# EAGLE design 454_mic (EAGLE 9.1.1)
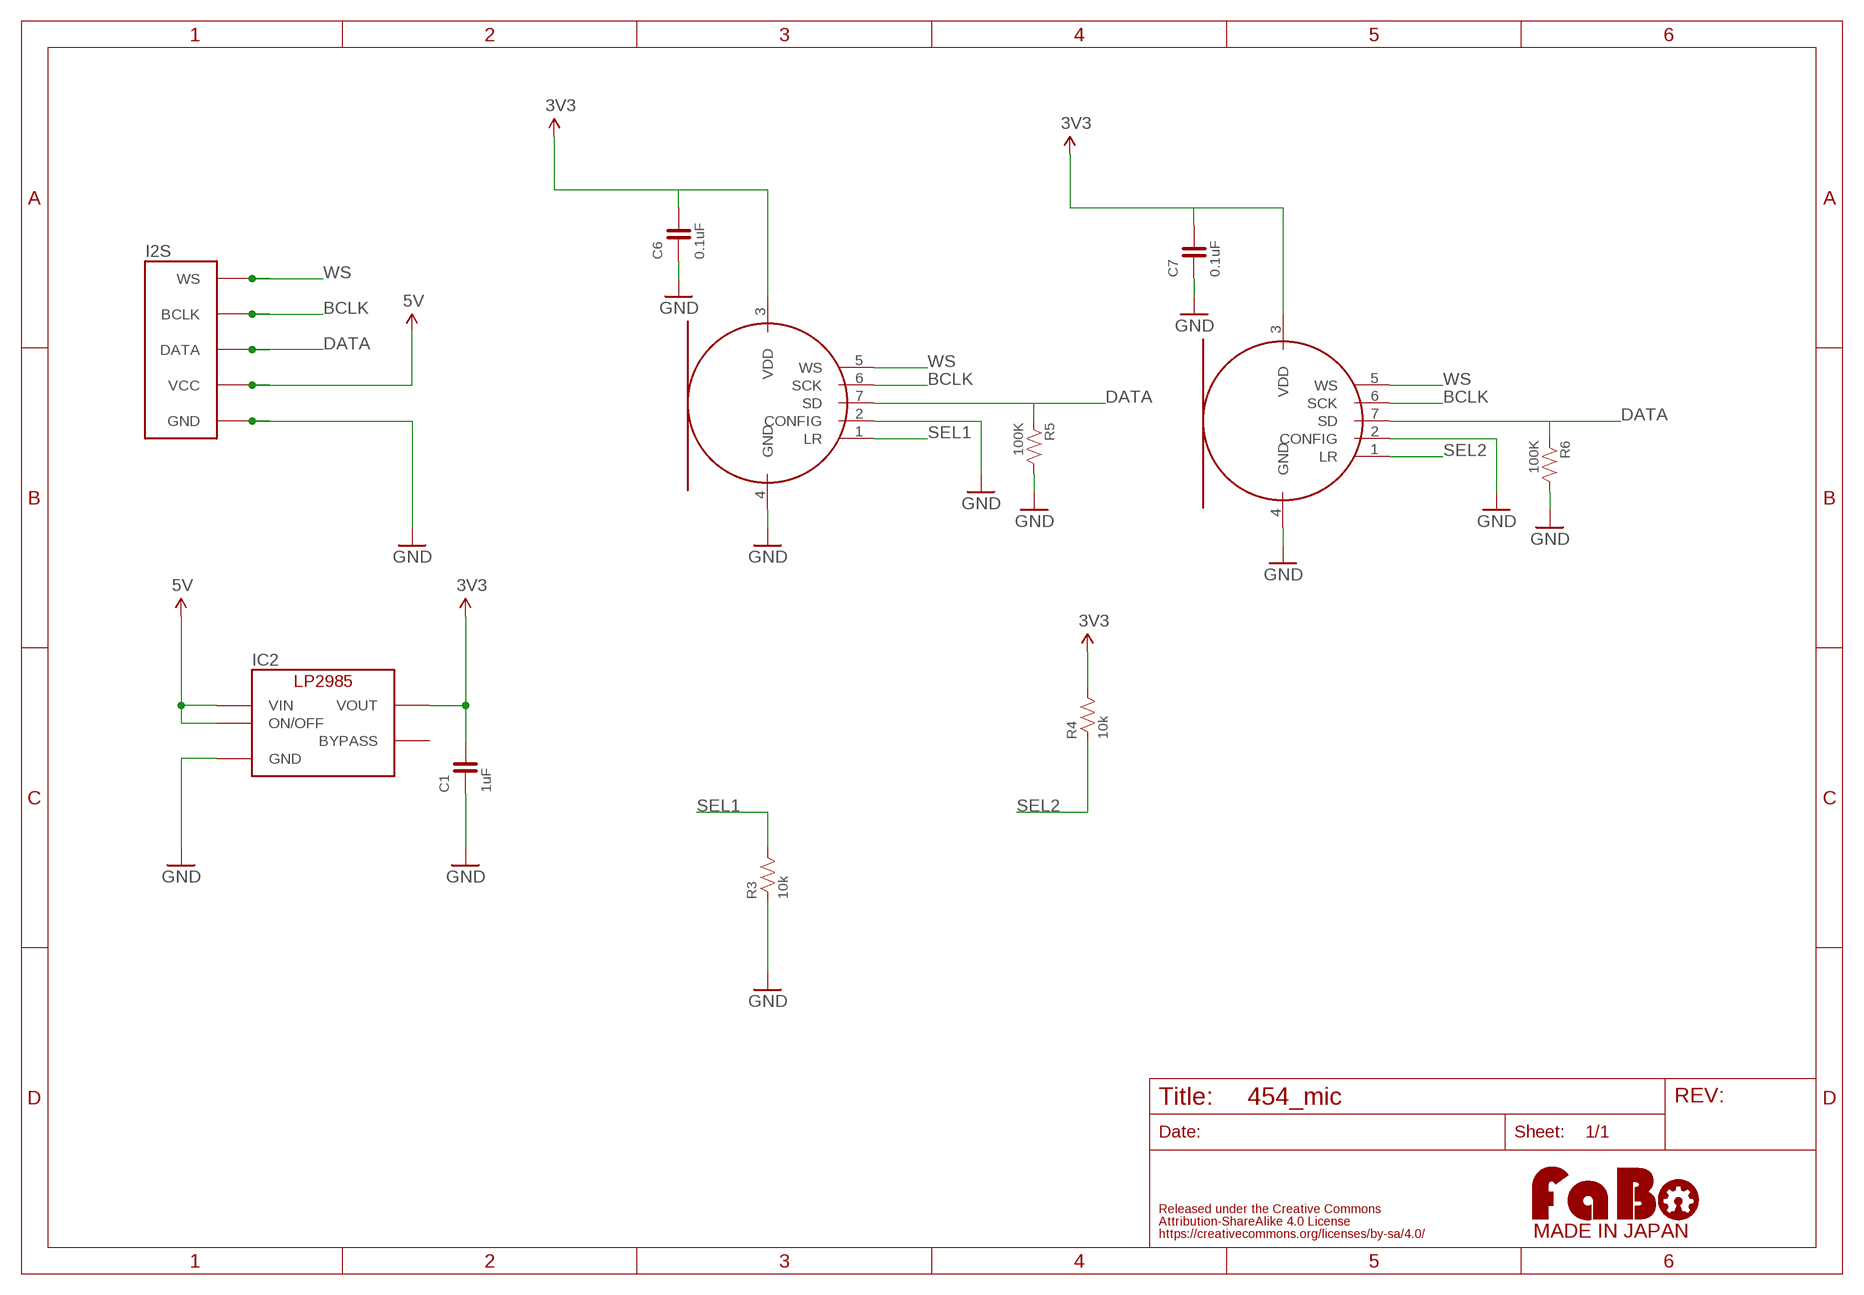
[diagram p0: schematic, sheet 1]

## Parts
C1  1uF  CAPACITOR-0603  [0603]
C6  0.1uF  CAPACITOR-0603  [0603]
C7  0.1uF  CAPACITOR-0603  [0603]
I2S  FABO_BRICK_I2SLONG  [FABO_BRICK_I2S_S05B-PASK-2_LONG]
IC2  LP2985-33DBV  [SOT-23-5]
MIC_LEFT  TDK-ICS43432  [TDK-ICS43432]
MIC_RIGHT  TDK-ICS43432  [TDK-ICS43432]
R3  10k  RESISTOR-0603  [0603]
R4  10k  RESISTOR-0603  [0603]
R5  100K  RESISTOR-0603  [0603]
R6  100K  RESISTOR-0603  [0603]
U$3  LOGO_FABO-M_BOTTOM  [LOGO_FABO_MS_BOTTOM]

## Nets
3V3: C1.2 C6.2 C7.2 IC2.5(VOUT) MIC_LEFT.3(VDD) MIC_RIGHT.3(VDD) R4.2
5V: I2S.VCC IC2.1(VIN) IC2.3(ON/OFF)
BCLK: I2S.BCLK MIC_LEFT.6(SCK) MIC_RIGHT.6(SCK)
DATA: I2S.DATA MIC_LEFT.7(SD) MIC_RIGHT.7(SD) R5.1 R6.1
GND: C1.1 C6.1 C7.1 I2S.GND IC2.2(GND) MIC_LEFT.2(CONFIG) MIC_LEFT.4(GND) MIC_RIGHT.2(CONFIG) MIC_RIGHT.4(GND) R3.1 R5.2 R6.2
SEL1: MIC_LEFT.1(LR) R3.2
SEL2: MIC_RIGHT.1(LR) R4.1
WS: I2S.WS MIC_LEFT.5(WS) MIC_RIGHT.5(WS)
Unconnected: IC2.4(BYPASS)

## Library data of the parts
C1 C6 C7 = FaBo-Capacitor:CAPACITOR: CAPACITOR
I2S = FaBo-Template:FABO_BRICK_I2S
IC2 = FaBo-Supply:LP2985: LP2985
MIC_LEFT MIC_RIGHT = FaBo-Mems:TDK-ICS43432
R3-R6 = FaBo-Resistors:RESISTOR: RESISTOR
U$3 = FaBo-etc:LOGO_FABO

## Board
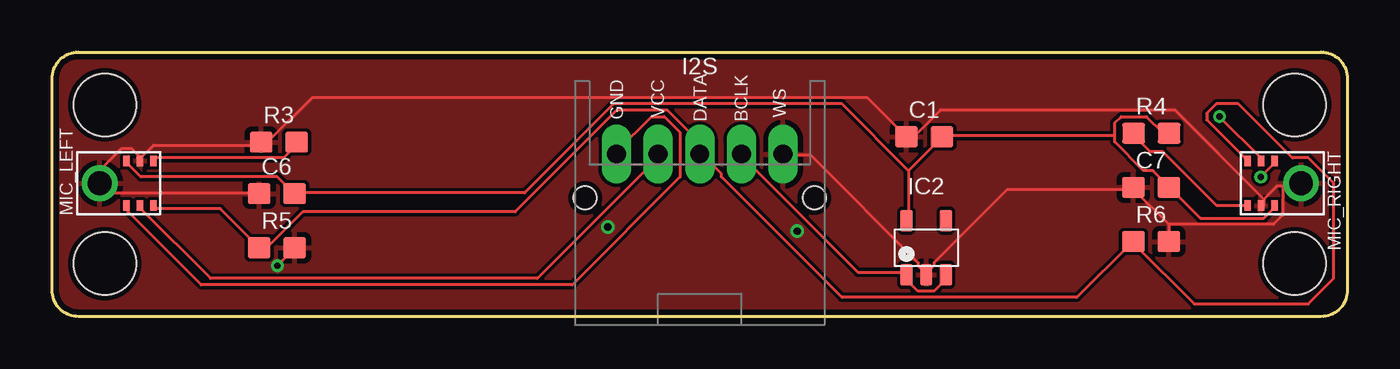
[diagram p1: board, top side]
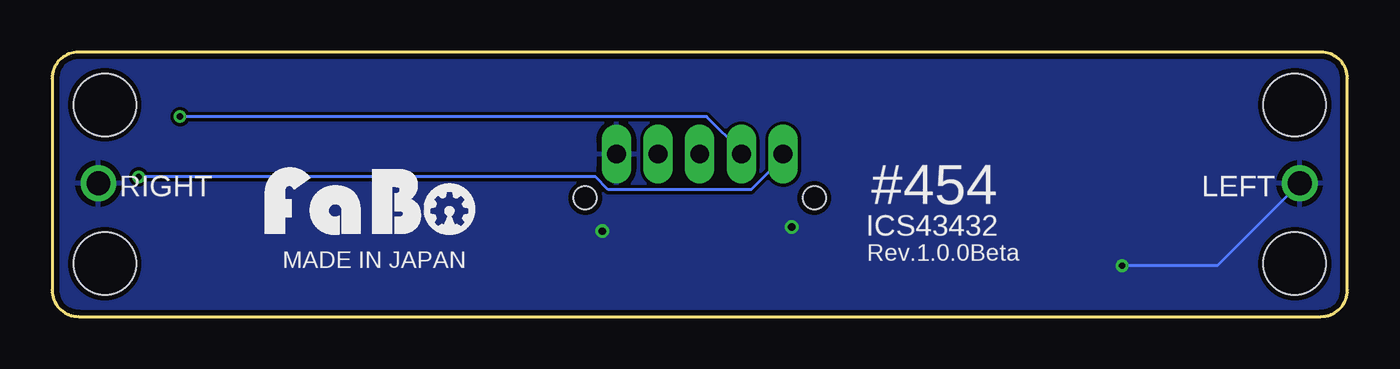
[diagram p2: board, bottom side, seen from below]

Size 62.23 x 12.7 mm. Coordinates in mm from the lower left corner, seen from the top.
Outline: 1.27,12.7 60.96,12.7 arc-90 62.23,11.43 62.23,1.27 arc-90 60.96,0 1.27,0 arc-90 0,1.27 0,11.43 arc-90 1.27,12.7
Copper layers (1*16): Top 0.035mm / dielectric 1.5mm / Bottom 0.035mm
Design rules "Elecrow_angle": minimum track width 6mil, minimum drill 12mil, track to track 6mil, track to pad 6mil, pad to pad 6mil, via to via 6mil, smd to smd 0mil, copper to edge 10mil, drill to drill 10mil, minimum pad ring 10mil, minimum via ring 6mil, stop-mask expansion 2mil, vias tented up to drill 100mil, thermal gap 10mil
Holes 3 mm at 2.54,10.16 2.54,2.54 59.69,10.16 59.69,2.54

### Footprints (pad centres in the part's own frame; a part is rotated, then mirrored left to right if it is on the bottom)
0603 = smd 1.1 x 1: 1 -0.85,0; 2 0.85,0
FABO_BRICK_I2S_S05B-PASK-2_LONG = drill 0.9 pad 1.422 long: BCLK 3,0; DATA 1,0; GND -3,0; VCC -1,0; WS 5,0 | hole 1.1: 6.5,2.1; -4.5,2.1
SOT-23-5 = smd 0.6 x 1.05: 1 -0.95,-1.3; 2 0,-1.3; 3 0.95,-1.3; 4 0.95,1.3; 5 -0.95,1.3
TDK-ICS43432 = smd 0.5 x 0.3: 1 1.075,-2.575; 2 1.075,-1.925; 3 1.075,-1.275; 5 -1.075,-1.275; 6 -1.075,-1.925; 7 -1.075,-2.575 | drill 1.15 pad 1.65: 4 0,0

### Placement (x,y rotation side)
C1  41.9,8.63 0 top
C6  10.8,5.9 0 top
C7  52.8,6.2 0 top
I2S  32.12,7.8 180 top
IC2  41.99,3.31 0 top
MIC_LEFT  2.3,6.4 90 top
MIC_RIGHT  60,6.4 270 top
R3  10.89,8.38 0 top
R4  52.81,8.8 0 top
R5  10.8,3.3 0 top
R6  52.8,3.6 0 top
U$3  46.95,3.54 0 top

### Tracks (layer width: path | path; a pad name or v marks a point on that pad's centre or on a via)
3V3
  Top 0.152: MIC_LEFT.3 3.66,7.47 3.66,7.32 4.27,6.71 10.82,6.71 11.58,5.94 C6.2 11.73,5.94 22.71,5.94 26.98,10.21 37.95,10.21 41.15,7.01 | 41.15,7.01 41.15,4.72 IC2.5 | 41.15,7.01 42.67,8.53 C1.2 42.82,8.69 51.05,8.69 | MIC_RIGHT.3 58.67,5.18 58.22,4.72 55.17,4.72 53.8,6.1 C7.2 53.65,6.25 52.88,7.01 52.43,7.01 51.05,8.38 51.05,8.69 | 51.05,8.69 51.05,9.3 51.36,9.6 52.58,9.6 53.34,8.84 53.65,8.84 R4.2
5V
  Top 0.152: IC2.3 42.82,1.98 42.82,1.68 42.37,1.22 41.6,1.22 41.15,1.68 41.15,1.98 IC2.1 41,2.13 38.71,2.13 33.07,7.77 I2S.VCC
BCLK  (via drill 0.3)
  Top 0.152: MIC_LEFT.6 4.27,5.18 7.62,1.83 23.32,1.83 29.26,7.77 I2S.BCLK | v56.08,9.6 58.06,7.62 MIC_RIGHT.6
  Bottom 0.152: v56.08,9.6 30.79,9.6 29.11,7.92 I2S.BCLK
DATA
  Top 0.152: MIC_LEFT.7 4.88,5.18 8.08,5.18 9.91,3.35 R5.1 10.06,3.35 10.36,3.35 12.04,5.03 22.25,5.03 27.13,9.91 29.57,9.91 31.09,8.38 31.09,7.92 I2S.DATA 31.24,7.77 32.16,6.86 32.16,6.71 37.95,0.91 49.23,0.91 51.82,3.5 R6.1 51.97,3.5 54.86,0.61 60.35,0.61 61.57,1.83 61.57,6.4 60.35,7.62 59.59,7.62 57,10.21 55.93,10.21 55.47,9.75 55.47,9.45 57.3,7.62 MIC_RIGHT.7
GND  (via drill 0.3, 0.35)
  Top 0.152: C6.1 9.91,5.94 2.74,5.94 2.44,6.25 MIC_LEFT.4 2.44,6.4 2.44,7.16 3.35,8.08 3.81,8.08 4.12,7.77 4.12,7.62 MIC_LEFT.2 4.27,7.62 4.88,8.23 9.91,8.23 R3.1 10.06,8.38 10.36,8.38 12.5,10.52 39.17,10.52 41,8.69 C1.1 41.15,8.69 41.45,8.69 42.67,9.91 53.95,9.91 58.22,5.64 | v10.82,2.44 11.58,3.2 R5.2 | I2S.GND 35.2,7.77 36.42,7.77 41.6,2.59 41.6,2.44 41.91,2.13 IC2.2 42.06,2.13 42.37,2.44 42.37,2.59 45.87,6.1 51.82,6.1 C7.1 51.97,6.1 53.65,4.42 | 53.65,4.42 53.65,3.66 R6.2 | 58.22,5.64 58.22,5.33 MIC_RIGHT.2 | 58.22,5.64 58.83,6.25 59.13,6.25 | 59.13,6.25 59.89,6.25 MIC_RIGHT.4 | 53.65,4.42 58.67,4.42 59.13,4.88 59.13,6.25
  Bottom 0.152: v10.82,2.44 6.25,2.44 2.44,6.25 MIC_LEFT.4
  other vias: 26.7,4.3 35.8,4.1
  pour Bottom: 0,0 0,12.7 62.23,12.7 62.23,0
  pour Top: 0,0 0,12.7 62.23,12.7 62.23,0
SEL1
  Top 0.152: MIC_LEFT.1 4.88,7.62 11.12,7.62 11.73,8.23 R3.2
SEL2
  Top 0.152: MIC_RIGHT.1 57.3,5.33 55.93,5.33 53.34,7.92 52.73,7.92 51.97,8.69 R4.1
WS  (via drill 0.3)
  Top 0.152: MIC_LEFT.5 3.66,5.18 3.66,5.03 7.16,1.52 24.99,1.52 30.18,6.71 30.18,8.84 29.41,9.6 28.8,9.6 27.13,7.92 I2S.WS | v58.06,6.71 58.67,7.32 58.67,7.47 MIC_RIGHT.5
  Bottom 0.152: v58.06,6.71 36.12,6.71 35.51,6.1 28.65,6.1 26.98,7.77 I2S.WS

### Text on the board
tPlace: VCC | WS | GND | DATA | BCLK
bPlace: LEFT | #454 | RIGHT | ICS43432 | Rev.1.0.0Beta | MADE IN JAPAN